# Altium schematic sheet 2-STM32H563.SchDoc: Thermocouple Temperature Logger
size A3; Date: 14.03.2026; Author: MG & JK; Revision: 1-0; SheetNumber: 2; SheetTotal: 7; Model: Rev 1.0; PageSetup: Record=PageOptions|CenterHorizontal=True|CenterVertical=True|PrintScale=0.52|XCorrection=1.00|YCorrection=1.00|PrintKind=1|BorderSize=5000000|LeftOffset=0|BottomOffset=0|Orientation=2|PaperLength=4200|PaperWidth=2970|Scale=100|PaperSource=7|PrintQuality=600|MediaType=1|DitherType=10|PaperKind=A3|PrintScaleMode=1
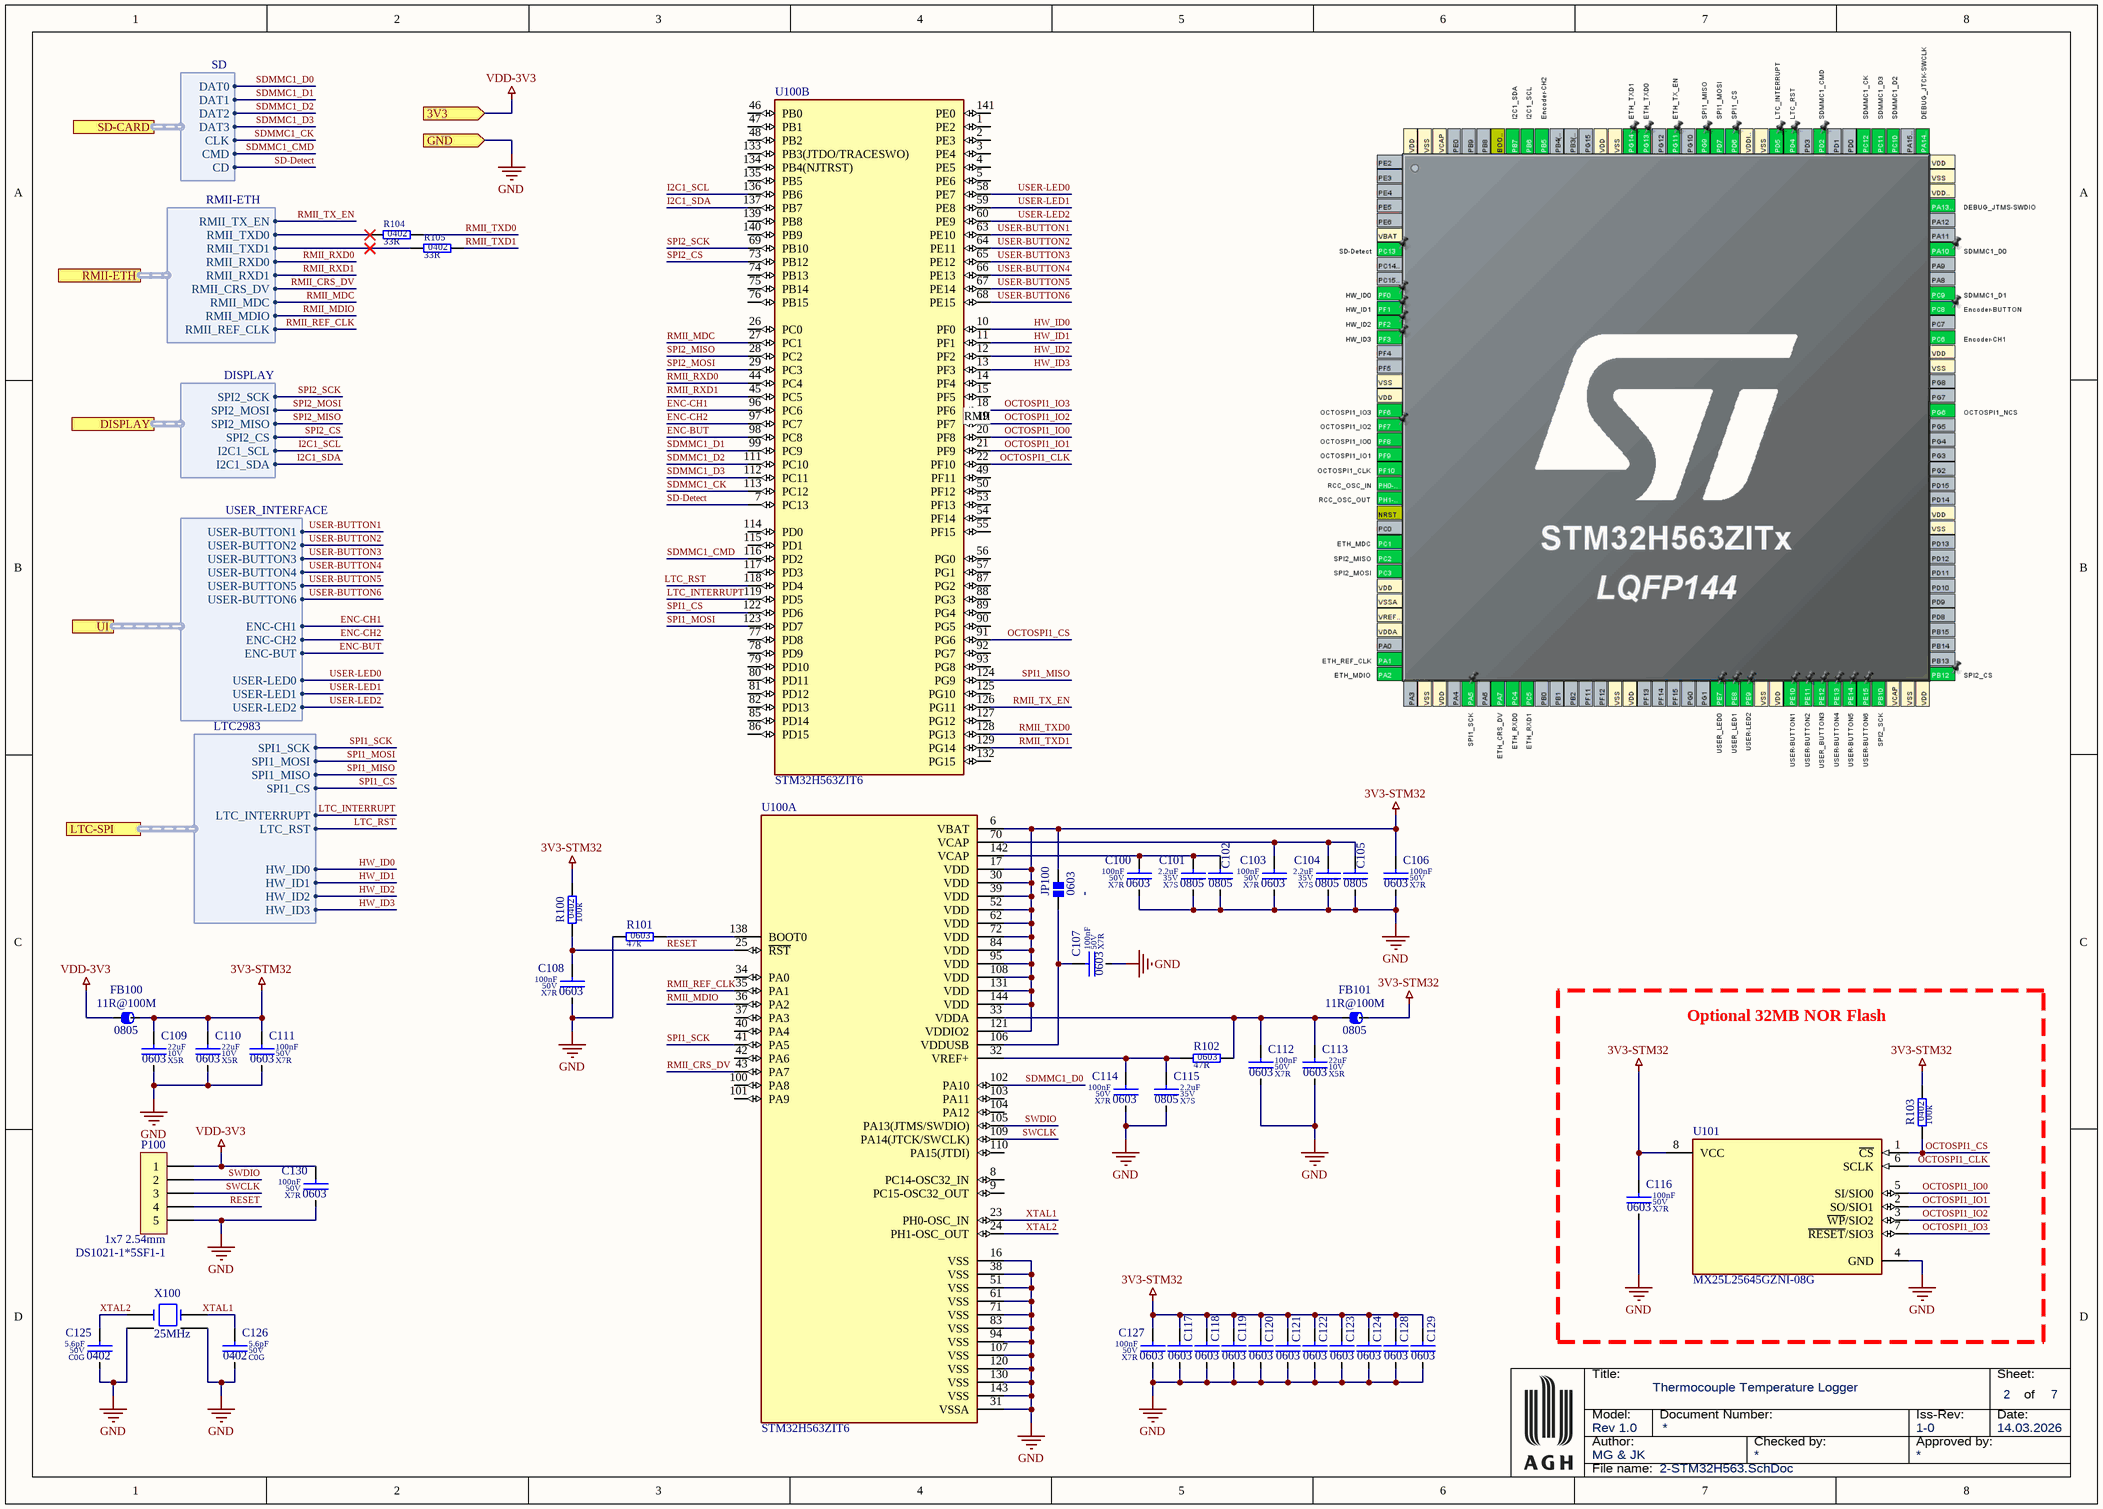
[diagram p0: 2-STM32H563.SchDoc]

## Parts
C100  value 100nF  Dielectric: X7R  Voltage: 50V  SCH_Footprint: 0603  [C_0603_1608]  (hidden comment: Ceramic X7R)
C101  value 2.2uF  Dielectric: X7S  Voltage: 35V  SCH_Footprint: 0805  [C_0805_2012]  (hidden comment: Ceramic X7S)
C102  SCH_Footprint: 0805  [C_0805_2012]  (hidden comment: Ceramic X7S)
C103  value 100nF  Dielectric: X7R  Voltage: 50V  SCH_Footprint: 0603  [C_0603_1608]  (hidden comment: Ceramic X7R)
C104  value 2.2uF  Dielectric: X7S  Voltage: 35V  SCH_Footprint: 0805  [C_0805_2012]  (hidden comment: Ceramic X7S)
C105  SCH_Footprint: 0805  [C_0805_2012]  (hidden comment: Ceramic X7S)
C106  value 100nF  Dielectric: X7R  Voltage: 50V  SCH_Footprint: 0603  [C_0603_1608]  (hidden comment: Ceramic X7R)
C107  value 100nF  Dielectric: X7R  Voltage: 50V  SCH_Footprint: 0603  [C_0603_1608]  (hidden comment: Ceramic X7R)
C108  value 100nF  Dielectric: X7R  Voltage: 50V  SCH_Footprint: 0603  [C_0603_1608]  (hidden comment: Ceramic X7R)
C109  value 22uF  Dielectric: X5R  Voltage: 10V  SCH_Footprint: 0603  [C_0603_1608]  (hidden comment: Ceramic X5R)
C110  value 22uF  Dielectric: X5R  Voltage: 10V  SCH_Footprint: 0603  [C_0603_1608]  (hidden comment: Ceramic X5R)
C111  value 100nF  Dielectric: X7R  Voltage: 50V  SCH_Footprint: 0603  [C_0603_1608]  (hidden comment: Ceramic X7R)
C112  value 100nF  Dielectric: X7R  Voltage: 50V  SCH_Footprint: 0603  [C_0603_1608]  (hidden comment: Ceramic X7R)
C113  value 22uF  Dielectric: X5R  Voltage: 10V  SCH_Footprint: 0603  [C_0603_1608]  (hidden comment: Ceramic X5R)
C114  value 100nF  Dielectric: X7R  Voltage: 50V  SCH_Footprint: 0603  [C_0603_1608]  (hidden comment: Ceramic X7R)
C115  value 2.2uF  Dielectric: X7S  Voltage: 35V  SCH_Footprint: 0805  [C_0805_2012]  (hidden comment: Ceramic X7S)
C116  value 100nF  Dielectric: X7R  Voltage: 50V  SCH_Footprint: 0603  [C_0603_1608]  (hidden comment: Ceramic X7R)
C117  SCH_Footprint: 0603  [C_0603_1608]  (hidden comment: Ceramic X7R)
C118  SCH_Footprint: 0603  [C_0603_1608]  (hidden comment: Ceramic X7R)
C119  SCH_Footprint: 0603  [C_0603_1608]  (hidden comment: Ceramic X7R)
C120  SCH_Footprint: 0603  [C_0603_1608]  (hidden comment: Ceramic X7R)
C121  SCH_Footprint: 0603  [C_0603_1608]  (hidden comment: Ceramic X7R)
C122  SCH_Footprint: 0603  [C_0603_1608]  (hidden comment: Ceramic X7R)
C123  SCH_Footprint: 0603  [C_0603_1608]  (hidden comment: Ceramic X7R)
C124  SCH_Footprint: 0603  [C_0603_1608]  (hidden comment: Ceramic X7R)
C125  value 5.6pF  Dielectric: C0G  Voltage: 50V  SCH_Footprint: 0402  [C_0402_1005]  (hidden comment: Ceramic C0G)
C126  value 5.6pF  Dielectric: C0G  Voltage: 50V  SCH_Footprint: 0402  [C_0402_1005]  (hidden comment: Ceramic C0G)
C127  value 100nF  Dielectric: X7R  Voltage: 50V  SCH_Footprint: 0603  [C_0603_1608]  (hidden comment: Ceramic X7R)
C128  SCH_Footprint: 0603  [C_0603_1608]  (hidden comment: Ceramic X7R)
C129  SCH_Footprint: 0603  [C_0603_1608]  (hidden comment: Ceramic X7R)
C130  value 100nF  Dielectric: X7R  Voltage: 50V  SCH_Footprint: 0603  [C_0603_1608]  (hidden comment: Ceramic X7R)
FB100  value 11R@100M  SCH_Footprint: 0805  [FB_0805_2012]  (hidden comment: Ferrite bead)
FB101  value 11R@100M  SCH_Footprint: 0805  [FB_0805_2012]  (hidden comment: Ferrite bead)
JP100  SCH_Footprint: 0603  [JP_0603_1608]  (hidden comment: Solder Jumper 0603/1608)
P100  value DS1021-1*5SF1-1  SCH_Footprint: 1x7 2.54mm  [P_HEADER_1x5_2.54]  (hidden comment: Goldpin)
R100  value 100k  SCH_Footprint: 0402  [R_0402_1005]  (hidden comment: Resistor)
R101  value 47k  SCH_Footprint: 0603  [R_0603_1608]  (hidden comment: Resistor)
R102  value 47R  SCH_Footprint: 0603  [R_0603_1608]  (hidden comment: Resistor)
R103  value 100k  SCH_Footprint: 0402  [R_0402_1005]  (hidden comment: Resistor)
R104  value 33R  SCH_Footprint: 0402  [R_0402_1005]  (hidden comment: Resistor)
R105  value 33R  SCH_Footprint: 0402  [R_0402_1005]  (hidden comment: Resistor)
U100  STM32H563ZIT6  [QFP50P2200X2200X160-144N]  (parts A,B of 2)
U101  MX25L25645GZNI-08G  [SOIC-8-4X5X18]
X100  value 25MHz  [X_2x1.6_4PIN]  (hidden comment: 32 MHz Oscilator)

## Blocks framed on the sheet
Optional 32MB NOR Flash: C116 R103 U101

## Ports
3V3 (in, see 1-Block-diagram[2B], 3-Power-Supply[2D], 4-Ethernet[1A], 5-SD-Card[1A], 6-Connectors[1A]), DISPLAY (harness DISPLAY, see 1-Block-diagram[3B], 6-Connectors[1B]), GND (in, see 1-Block-diagram[2B], 3-Power-Supply[3A], 4-Ethernet[1A], 5-SD-Card[1A], 6-Connectors[1A], 7-LTC2983[1A]), LTC-SPI (harness LTC2983, see 1-Block-diagram[3B], 7-LTC2983[1B]), RMII-ETH (harness RMII-ETH, see 1-Block-diagram[3B], 4-Ethernet[1A]), SD-CARD (harness SD, see 1-Block-diagram[3B], 5-SD-Card[3B]), UI (harness USER_INTERFACE, see 1-Block-diagram[3B], 6-Connectors[1C])

## Harnesses
SD: DAT0, DAT1, DAT2, DAT3, CLK, CMD, CD
RMII-ETH: RMII_TX_EN, RMII_TXD0, RMII_TXD1, RMII_RXD0, RMII_RXD1, RMII_CRS_DV, RMII_MDC, RMII_MDIO, RMII_REF_CLK
LTC2983: SPI1_SCK, SPI1_MOSI, SPI1_MISO, SPI1_CS, HW_ID3, HW_ID2, HW_ID1, HW_ID0, LTC_INTERRUPT, LTC_RST
DISPLAY: SPI2_SCK, SPI2_MOSI, SPI2_MISO, SPI2_CS, I2C1_SCL, I2C1_SDA
USER_INTERFACE: ENC-CH2, ENC-BUT, USER-BUTTON1, USER-BUTTON2, USER-BUTTON3, USER-BUTTON4, USER-BUTTON5, USER-BUTTON6, ENC-CH1, USER-LED2, USER-LED1, USER-LED0

## Nets
3V3-STM32: C106.1 C109.1 C110.1 C111.1 C116.1 C117.1 C118.1 C119.1 C120.1 C121.1 C122.1 C123.1 C124.1 C127.1 C128.1 C129.1 FB100.2 FB101.2 JP100.2 R100.2 R103.2 U100.6(VBAT) U100.17(VDD) U100.30(VDD) U100.39(VDD) U100.52(VDD) U100.62(VDD) U100.72(VDD) U100.84(VDD) U100.95(VDD) U100.108(VDD) U100.121(VDDIO2) U100.131(VDD) U100.144(VDD) U101.8(VCC)
GND: C100.2 C101.2 C102.2 C103.2 C104.2 C105.2 C106.2 C107.2 C108.2 C109.2 C110.2 C111.2 C112.2 C113.2 C114.2 C115.2 C116.2 C117.2 C118.2 C119.2 C120.2 C121.2 C122.2 C123.2 C124.2 C125.2 C126.2 C127.2 C128.2 C129.2 C130.2 P100.5 R101.1 U100.16(VSS) U100.31(VSSA) U100.38(VSS) U100.51(VSS) U100.61(VSS) U100.71(VSS) U100.83(VSS) U100.94(VSS) U100.107(VSS) U100.120(VSS) U100.130(VSS) U100.143(VSS) U101.4(GND) X100.2(GND) X100.4(GND) ; port GND
VDD-3V3: C130.1 FB100.1 P100.1 ; port 3V3
ENC-BUT: U100.98(PC8) ; port UI.ENC-BUT
ENC-CH1: U100.96(PC6) ; port UI.ENC-CH1
ENC-CH2: U100.97(PC7) ; port UI.ENC-CH2
HW_ID0: U100.10(PF0) ; port LTC-SPI.HW_ID0
HW_ID1: U100.11(PF1) ; port LTC-SPI.HW_ID1
HW_ID2: U100.12(PF2) ; port LTC-SPI.HW_ID2
HW_ID3: U100.13(PF3) ; port LTC-SPI.HW_ID3
I2C1_SCL: U100.136(PB6) ; port DISPLAY.I2C1_SCL
I2C1_SDA: U100.137(PB7) ; port DISPLAY.I2C1_SDA
LTC_INTERRUPT: U100.119(PD5) ; port LTC-SPI.LTC_INTERRUPT
LTC_RST: U100.118(PD4) ; port LTC-SPI.LTC_RST
OCTOSPI1_CLK: U100.22(PF10) U101.6(SCLK)
OCTOSPI1_CS: R103.1 U100.91(PG6) U101.1(~{CS})
OCTOSPI1_IO0: U100.20(PF8) U101.5(SI/SIO0)
OCTOSPI1_IO1: U100.21(PF9) U101.2(SO/SIO1)
OCTOSPI1_IO2: U100.19(PF7) U101.3(~{WP}/SIO2)
OCTOSPI1_IO3: U100.18(PF6) U101.7(~{RESET}/SIO3)
RESET: C108.1 P100.4 R100.1 U100.25(~{RST})
RMII_CRS_DV: U100.43(PA7) ; port RMII-ETH.RMII_CRS_DV
RMII_MDC: U100.27(PC1) ; port RMII-ETH.RMII_MDC
RMII_MDIO: U100.36(PA2) ; port RMII-ETH.RMII_MDIO
RMII_REF_CLK: U100.35(PA1) ; port RMII-ETH.RMII_REF_CLK
RMII_RXD0: U100.44(PC4) ; port RMII-ETH.RMII_RXD0
RMII_RXD1: U100.45(PC5) ; port RMII-ETH.RMII_RXD1
RMII_TX_EN: U100.126(PG11) ; port RMII-ETH.RMII_TX_EN
RMII_TXD0: R104.2 U100.128(PG13)
RMII_TXD1: R105.2 U100.129(PG14)
SD-Detect: U100.7(PC13) ; port SD-CARD.CD
SDMMC1_CK: U100.113(PC12) ; port SD-CARD.CLK
SDMMC1_CMD: U100.116(PD2) ; port SD-CARD.CMD
SDMMC1_D0: U100.102(PA10) ; port SD-CARD.DAT0
SDMMC1_D1: U100.99(PC9) ; port SD-CARD.DAT1
SDMMC1_D2: U100.111(PC10) ; port SD-CARD.DAT2
SDMMC1_D3: U100.112(PC11) ; port SD-CARD.DAT3
SPI1_CS: U100.122(PD6) ; port LTC-SPI.SPI1_CS
SPI1_MISO: U100.124(PG9) ; port LTC-SPI.SPI1_MISO
SPI1_MOSI: U100.123(PD7) ; port LTC-SPI.SPI1_MOSI
SPI1_SCK: U100.41(PA5) ; port LTC-SPI.SPI1_SCK
SPI2_CS: U100.73(PB12) ; port DISPLAY.SPI2_CS
SPI2_MISO: U100.28(PC2) ; port DISPLAY.SPI2_MISO
SPI2_MOSI: U100.29(PC3) ; port DISPLAY.SPI2_MOSI
SPI2_SCK: U100.69(PB10) ; port DISPLAY.SPI2_SCK
SWCLK: P100.3 U100.109(PA14(JTCK/SWCLK))
SWDIO: P100.2 U100.105(PA13(JTMS/SWDIO))
USER-BUTTON1: U100.63(PE10) ; port UI.USER-BUTTON1
USER-BUTTON2: U100.64(PE11) ; port UI.USER-BUTTON2
USER-BUTTON3: U100.65(PE12) ; port UI.USER-BUTTON3
USER-BUTTON4: U100.66(PE13) ; port UI.USER-BUTTON4
USER-BUTTON5: U100.67(PE14) ; port UI.USER-BUTTON5
USER-BUTTON6: U100.68(PE15) ; port UI.USER-BUTTON6
USER-LED0: U100.58(PE7) ; port UI.USER-LED0
USER-LED1: U100.59(PE8) ; port UI.USER-LED1
USER-LED2: U100.60(PE9) ; port UI.USER-LED2
XTAL1: C126.1 U100.23(PH0-OSC_IN) X100.1
XTAL2: C125.1 U100.24(PH1-OSC_OUT) X100.3
NetC100_1: C100.1 C101.1 C102.1 U100.142(VCAP)
NetC103_1: C103.1 C104.1 C105.1 U100.70(VCAP)
NetC107_1: C107.1 JP100.1 U100.106(VDDUSB)
NetC112_1: C112.1 C113.1 FB101.1 R102.2 U100.33(VDDA)
NetC114_1: C114.1 C115.1 R102.1 U100.32(VREF+)
NetR101_2: R101.2 U100.138(BOOT0)
NetR104_1: R104.1 ; port RMII-ETH.RMII_TXD0
NetR105_1: R105.1 ; port RMII-ETH.RMII_TXD1

Not connected (* = marked no-connect by the designer): U100 1(PE2) 2(PE3) 3(PE4) 4(PE5) 5(PE6) 8(PC14-OSC32_IN) 9(PC15-OSC32_OUT) 14(PF4) 15(PF5) 26(PC0) 34(PA0) 37(PA3) 40(PA4) 42(PA6) 46(PB0) 47(PB1) 48(PB2) 49(PF11) 50(PF12) 53(PF13) 54(PF14) 55(PF15) 56(PG0) 57(PG1) 74(PB13) 75(PB14) 76(PB15) 77(PD8) 78(PD9) 79(PD10) 80(PD11) 81(PD12) 82(PD13) 85(PD14) 86(PD15) 87(PG2) 88(PG3) 89(PG4) 90(PG5) 92(PG7) 93(PG8) 100(PA8) 101(PA9) 103(PA11) 104(PA12) 110(PA15(JTDI)) 114(PD0) 115(PD1) 117(PD3) 125(PG10) 127(PG12) 132(PG15) 133(PB3(JTDO/TRACESWO)) 134(PB4(NJTRST)) 135(PB5) 139(PB8) 140(PB9) 141(PE0)

## Notes on the sheet
- (near U100) RMII
- Title:
- Sheet:
- of
- Author:
- Model:
- Document Number:
- Checked by:
- Iss-Rev:
- Approved by:
- Date:
- File name:

## Library data of the parts
C100 C103 C106-C108 C111 C112 C114 C116 C127 C130 = C_100nF_50V_X7R_0603_10_AECQ1: Capacitor; Manufacturer: Murata; Manufacturer Part Number: GCM188R71H104KA57D; Tolerance (%): 10; AEC-Q: 1; Part Number: C_100nF_50V_X7R_0603_10_AECQ1; HelpURL: https://www.murata.com/products/productdetail?partno=GCM188R71H104KA57%23; Supplier 1: TME; Supplier Part Number 1: GCM188R71H104KA57D; Supplier 2: RS Components; Supplier 3: Farnell; Supplier Part Number 3: 4360223; Supplier 4: Mouser; Supplier Part Number 4: 81-GCM188R71H104KA7D; Supplier 5: Digi-Key; Supplier Part Number 5: 490-4779-1-ND; Supplier 6: LCSC; Supplier Part Number 6: C85864
C101 C104 C115 = C_2.2uF_35V_X7S_0805_10_AECQ1: Capacitor; Manufacturer: Murata; Manufacturer Part Number: GCM21BC7YA225KE02; Tolerance (%): 10; AEC-Q: 1; Part Number: C_2.2uF_35V_X7S_0805_10_AECQ1; HelpURL: https://www.murata.com/products/productdetail?partno=GCM21BC7YA225KE02%23; Supplier 1: TME; Supplier Part Number 1: GCM21BC7YA225KE02L; Supplier 2: RS Components; Supplier 3: Farnell; Supplier Part Number 3: 3784380; Supplier 4: Mouser; Supplier Part Number 4: 81-GCM21BC7YA225KE2L; Supplier 5: Digi-Key; Supplier Part Number 5: 490-16390-1-ND; Supplier 6: LCSC; Supplier Part Number 6: C389007
C102 C105 = C_2.2uF_35V_X7S_0805_10_AECQ1: Capacitor; Manufacturer: Murata; Manufacturer Part Number: GCM21BC7YA225KE02; Voltage: 35V; Value: 2.2uF; Tolerance (%): 10; AEC-Q: 1; Dielectric: X7S; Part Number: C_2.2uF_35V_X7S_0805_10_AECQ1; HelpURL: https://www.murata.com/products/productdetail?partno=GCM21BC7YA225KE02%23; Supplier 1: TME; Supplier Part Number 1: GCM21BC7YA225KE02L; Supplier 2: RS Components; Supplier 3: Farnell; Supplier Part Number 3: 3784380; Supplier 4: Mouser; Supplier Part Number 4: 81-GCM21BC7YA225KE2L; Supplier 5: Digi-Key; Supplier Part Number 5: 490-16390-1-ND; Supplier 6: LCSC; Supplier Part Number 6: C389007
C109 C110 C113 = C_22uF_10V_X5R_0603_20: Capacitor; Manufacturer: Murata; Manufacturer Part Number: GRM188R61A226ME15D; Tolerance (%): 20; Part Number: C_22uF_10V_X5R_0603_20; HelpURL: https://www.mouser.pl/datasheet/2/281/1/GRM188R61A226ME15_02A-1985787.pdf; Supplier 1: TME; Supplier Part Number 1: GRM188R61A226ME15D; Supplier 2: RS Components; Supplier 3: Farnell; Supplier Part Number 3: 2426957; Supplier 4: Mouser; Supplier Part Number 4: 81-GRM188R61A226ME5D; Supplier 5: Digi-Key; Supplier Part Number 5: 490-10476-1-ND; Supplier 6: LCSC
C117-C124 C128 C129 = C_100nF_50V_X7R_0603_10_AECQ1: Capacitor; Manufacturer: Murata; Manufacturer Part Number: GCM188R71H104KA57D; Voltage: 50V; Value: 100nF; Tolerance (%): 10; AEC-Q: 1; Dielectric: X7R; Part Number: C_100nF_50V_X7R_0603_10_AECQ1; HelpURL: https://www.murata.com/products/productdetail?partno=GCM188R71H104KA57%23; Supplier 1: TME; Supplier Part Number 1: GCM188R71H104KA57D; Supplier 2: RS Components; Supplier 3: Farnell; Supplier Part Number 3: 4360223; Supplier 4: Mouser; Supplier Part Number 4: 81-GCM188R71H104KA7D; Supplier 5: Digi-Key; Supplier Part Number 5: 490-4779-1-ND; Supplier 6: LCSC; Supplier Part Number 6: C85864
C125 C126 = C_5.6pF_50V_C0G_0402_2_AECQ1: Capacitor; Manufacturer: Murata; Manufacturer Part Number: GCM1555C1H5R6BA16D; Tolerance (%): 2; AEC-Q: 1; Part Number: C_5.6pF_50V_C0G_0402_2_AECQ1; HelpURL: https://www.murata.com/products/productdetail?partno=GCM1555C1H5R6BA16%23; Supplier 1: TME; Supplier Part Number 1: GCM1555C1H5R6BA16D; Supplier 2: RS Components; Supplier 3: Farnell; Supplier Part Number 3: 3581200; Supplier 4: Mouser; Supplier Part Number 4: 81-GCM1555C1H5R6BA6D; Supplier 5: Digi-Key; Supplier Part Number 5: 490-14424-1-ND; Supplier 6: LCSC; Supplier Part Number 6: C415376
FB100 FB101 = FB_2508051107Y0: Manufacturer: Fair-Rite; Current: 300mA; Resistance: 100mR; Part Number: FB_2508051107Y0; HelpURL: https://datasheet.octopart.com/2508051107Y0-Fair-Rite-datasheet-834.pdf; Manufacturer Part Number: 2508051107Y0; Supplier 1: TME; Supplier 2: RS Components; Supplier 3: Farnell; Supplier Part Number 3: 1612004; Supplier 4: Mouser; Supplier Part Number 4: 623-2508051107Y0; Supplier 5: Digi-Key; Supplier Part Number 5: 1934-1397-1-ND; Supplier 6: LCSC
JP100 = JP_0603_1608: Value: -; Part Number: JP_0603_1608; HelpURL: -; Manufacturer: -; Manufacturer Part Number: -; Supplier 1: TME; Supplier 2: RS Components; Supplier 3: Farnell; Supplier 4: Mouser; Supplier 5: Digi-Key; Supplier 6: LCSC
P100 = P_HEADER_1x5_2.54: Pin Header; Manufacturer: Connfly; Part Number: P_HEADER_1x5_2.54; HelpURL: http://datasheet.octopart.com/DS1021-1%2A5SF1-1-Connfly-datasheet-65537859.pdf; Manufacturer Part Number: DS1021-1*5SF1-1; Supplier 1: TME; Supplier Part Number 1: ZL201-05G; Supplier 2: RS Components; Supplier 3: Farnell; Supplier 4: Mouser; Supplier 5: Digi-Key; Supplier 6: LCSC
R100 R103 = R_100k_0402_1: Manufacturer: Yageo; Manufacturer Part Number: RC0402FR-07100KL; Voltage: 50V; Power: 63mW; Tolerance: 1%; Part Number: R_100k_0402_1; HelpURL: http://www.tme.eu/pl/Document/1a2bc76e2be68b3b1670068306778ce6/rc0402yageo.pdf; Supplier 1: TME; Supplier Part Number 1: RC0402FR-07100K; Supplier 2: RS Components; Supplier 3: Farnell; Supplier Part Number 3: 2131798; Supplier 4: Mouser; Supplier Part Number 4: 603-RC0402FR-07100KL; Supplier 5: Digi-Key; Supplier Part Number 5: 311-100KLRCT-ND; Supplier 6: LCSC
R101 = R_47k_0603_1_AECQ0: Manufacturer: Panasonic; Manufacturer Part Number: ERJ-3EKF4702V; Voltage: 75V; Power: 100mW; Tolerance: 1%; AEC-Q: 0; Part Number: R_47k_0603_1_AECQ0; HelpURL: https://industrial.panasonic.com/cdbs/www-data/pdf/RDA0000/AOA0000C304.pdf; Supplier 1: TME; Supplier Part Number 1: ERJ3EKF4702V; Supplier 2: RS Components; Supplier 3: Farnell; Supplier Part Number 3: 2303213; Supplier 4: Mouser; Supplier Part Number 4: 667-ERJ-3EKF4702V; Supplier 5: Digi-Key; Supplier Part Number 5: P47.0KHCT-ND; Supplier 6: LCSC
R102 = R_47R_0603_1: Manufacturer: Yageo; Manufacturer Part Number: RC0603FR-0747RL; Voltage: 75V; Power: 100mW; Tolerance: 1%; Part Number: R_47R_0603_1; HelpURL: https://datasheet.octopart.com/RC0603FR-0747RL-Yageo-datasheet-8328172.pdf; Supplier 1: TME; Supplier 2: RS Components; Supplier Part Number 2: 1995582; Supplier 3: Farnell; Supplier Part Number 3: 9238328; Supplier 4: Mouser; Supplier Part Number 4: 603-RC0603FR-0747RL; Supplier 5: Digi-Key; Supplier Part Number 5: 311-47.0HRCT-ND; Supplier 6: LCSC; Supplier Part Number 6: C114623
R104 R105 = R_33R_0402_1_AECQ0: Manufacturer: Panasonic; Manufacturer Part Number: ERJ-2RKF33R0X; Voltage: 50V; Power: 100mW; Tolerance: 1%; AEC-Q: 0; Part Number: R_33R_0402_1_AECQ0; HelpURL: https://industrial.panasonic.com/cdbs/www-data/pdf/RDA0000/AOA0000C304.pdf; Supplier 1: TME; Supplier Part Number 1: ERJ2RKF33R0X; Supplier 2: RS Components; Supplier 3: Farnell; Supplier Part Number 3: 2302472; Supplier 4: Mouser; Supplier Part Number 4: 667-ERJ-2RKF33R0X; Supplier 5: Digi-Key; Supplier Part Number 5: P33.0LCT-ND; Supplier 6: LCSC; Supplier Part Number 6: C278594
U100 = STM32H563ZIT6: ARMÂ® CortexÂ®-M33 STM32H5 Microcontroller IC 32-Bit 250MHz 2MB (2M x 8) FLASH 144-LQFP (20x20); MF: STMicroelectronics; SnapEDA_Link: https://www.snapeda.com/parts/STM32H563ZIT6/STMicroelectronics/view-part/?ref=snap; Package: LQFP-144 STMicroelectronics; Value: *; MP: STM32H563ZIT6; Check_prices: https://www.snapeda.com/parts/STM32H563ZIT6/STMicroelectronics/view-part/?ref=eda
U101 = MX25L25645GM2I-10G: IC FLSH 256MBIT SPI 120MHZ 8WSON; RoHS Compliant: Yes
X100 = X_NX2016SA-32M-EXS00A-CS06465: Part Number: NX2016SA-25.000M-STD-CZS-1; Manufacturer: NDK; SCH_Footprint: x1.6; Manufacturer Part Number: NX2016SA-25.000M-STD-CZS-1; HelpURL: https://pl.mouser.com/datasheet/2/905/ndk_08142018_NX2016SA-32M-EXS00A-CS06465_SS-1389053.pdf; Supplier 1: TME; Supplier 2: RS Components; Supplier 3: Farnell; Supplier 4: Mouser; Supplier Part Number 4: 344-NX2016SA32S06465; Supplier 5: Digi-Key; Supplier Part Number 5: 644-1300-1-ND; Supplier 6: LCSC